# Altium schematic sheet DIOT_Backplane.SchDoc: =title_ (part 1 of 2)
size 594 x 420 mm; Date: 24/04/2023; CheckedBy: EG; GD; GK; MS; DrawnBy: M. Gąska; DocumentNumber: 1; SheetNumber: 1; SheetTotal: 5; DivGrp: BE-CO; Projet: DI/OT Crate; Title2: Top; Designer: G.Daniluk; CreateDate: 24/04/2023; CheckedDate: 24/04/2023
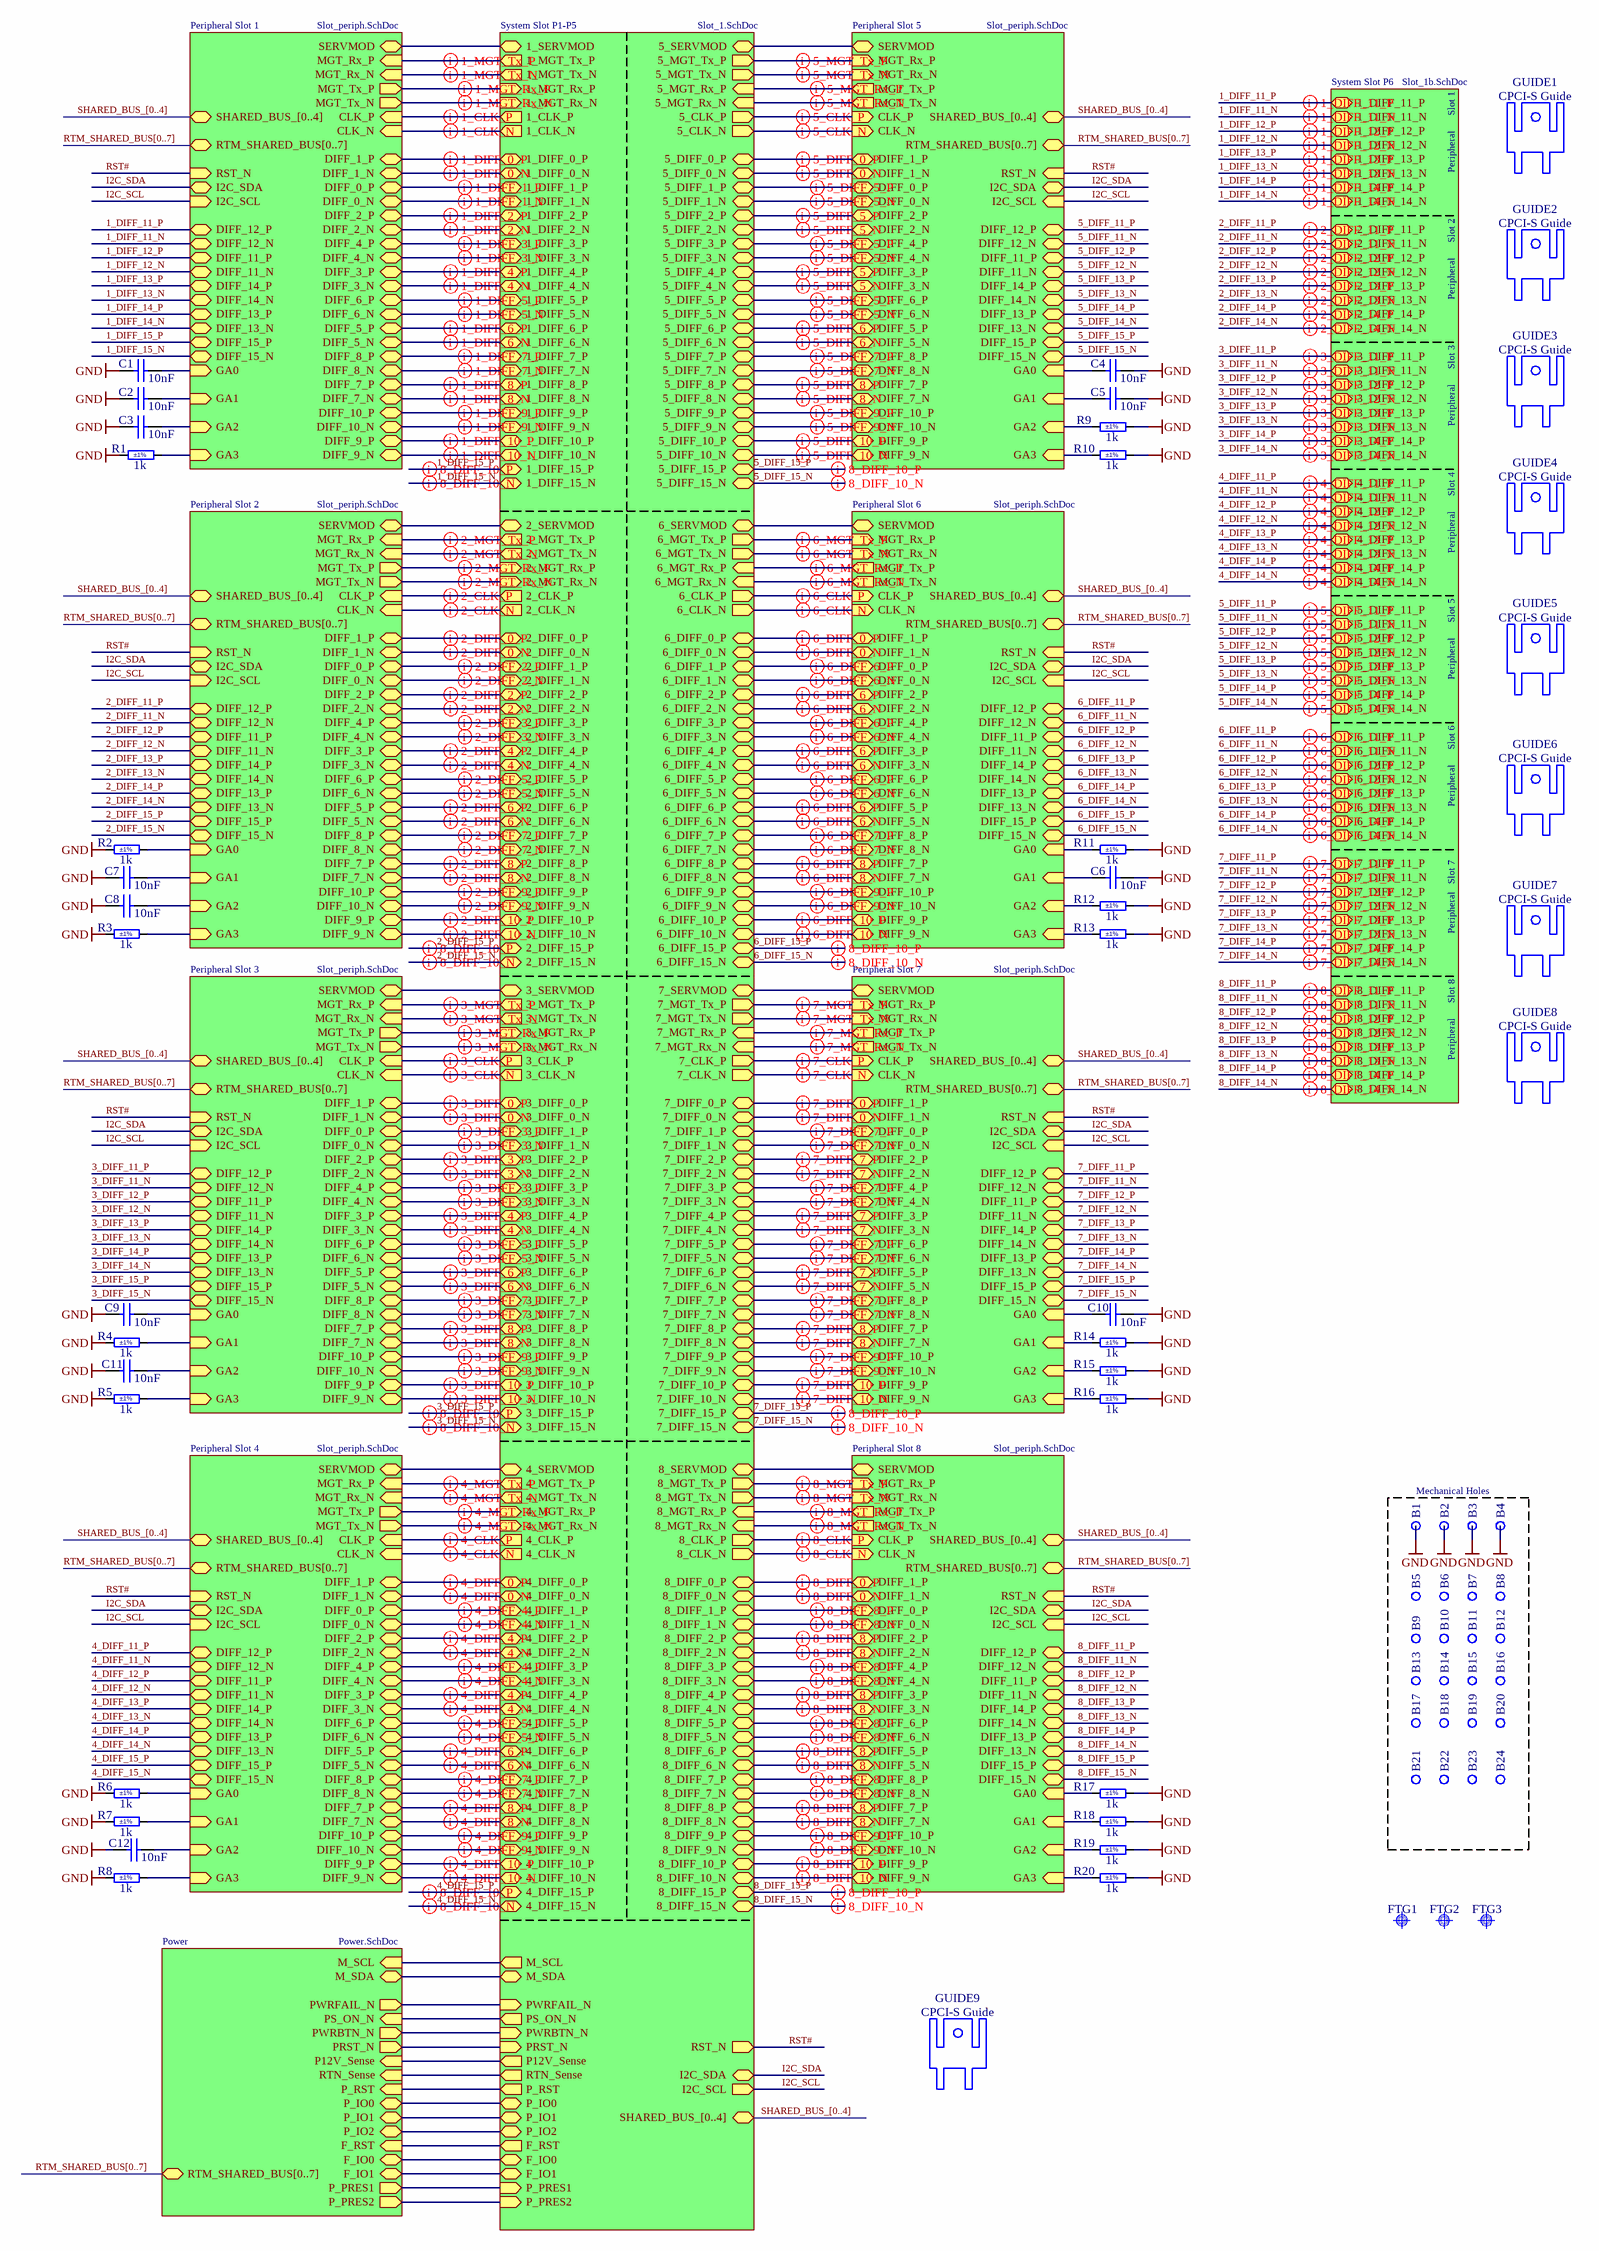
[diagram p0: DIOT_Backplane.SchDoc]

## Parts
B1  Non Plated Hole  [MTG270_500_NPTH_8FCVIAS_BOTSM]  (value not drawn)  (no BOM)
B2  Non Plated Hole  [MTG270_500_NPTH_8FCVIAS_BOTSM]  (value not drawn)  (no BOM)
B3  Non Plated Hole  [MTG270_500_NPTH_8FCVIAS_BOTSM]  (value not drawn)  (no BOM)
B4  Non Plated Hole  [MTG270_500_NPTH_8FCVIAS_BOTSM]  (value not drawn)  (no BOM)
B5  Non Plated Hole  [MTG270]  (value not drawn)  (no BOM)
B6  Non Plated Hole  [MTG270]  (value not drawn)  (no BOM)
B7  Non Plated Hole  [MTG270]  (value not drawn)  (no BOM)
B8  Non Plated Hole  [MTG270]  (value not drawn)  (no BOM)
B9  Non Plated Hole  [MTG270]  (value not drawn)  (no BOM)
B10  Non Plated Hole  [MTG270]  (value not drawn)  (no BOM)
B11  Non Plated Hole  [MTG270]  (value not drawn)  (no BOM)
B12  Non Plated Hole  [MTG270]  (value not drawn)  (no BOM)
B13  Non Plated Hole  [MTG270]  (value not drawn)  (no BOM)
B14  Non Plated Hole  [MTG270]  (value not drawn)  (no BOM)
B15  Non Plated Hole  [MTG270]  (value not drawn)  (no BOM)
B16  Non Plated Hole  [MTG270]  (value not drawn)  (no BOM)
B17  Non Plated Hole  [MTG270]  (value not drawn)  (no BOM)
B18  Non Plated Hole  [MTG270]  (value not drawn)  (no BOM)
B19  Non Plated Hole  [MTG270]  (value not drawn)  (no BOM)
B20  Non Plated Hole  [MTG270]  (value not drawn)  (no BOM)
B21  Non Plated Hole  [MTG270]  (value not drawn)  (no BOM)
B22  Non Plated Hole  [MTG270]  (value not drawn)  (no BOM)
B23  Non Plated Hole  [MTG270]  (value not drawn)  (no BOM)
B24  Non Plated Hole  [MTG270]  (value not drawn)  (no BOM)
C1  10nF  [CAPC1005X55N]
C2  10nF  [CAPC1005X55N]
C3  10nF  [CAPC1005X55N]
C4  10nF  [CAPC1005X55N]
C5  10nF  [CAPC1005X55N]
C6  10nF  [CAPC1005X55N]
C7  10nF  [CAPC1005X55N]
C8  10nF  [CAPC1005X55N]
C9  10nF  [CAPC1005X55N]
C10  10nF  [CAPC1005X55N]
C11  10nF  [CAPC1005X55N]
C12  10nF  [CAPC1005X55N]
FTG1  Use only in PCB  [FIDUCIAL_TOP_C100-200]  (value not drawn)
FTG2  Use only in PCB  [FIDUCIAL_TOP_C100-200]  (value not drawn)
FTG3  Use only in PCB  [FIDUCIAL_TOP_C100-200]  (value not drawn)
GUIDE1  CPCI-S Guide  [EDA-04126-V1-0]
GUIDE2  CPCI-S Guide  [EDA-04126-V1-0]
GUIDE3  CPCI-S Guide  [EDA-04126-V1-0]
GUIDE4  CPCI-S Guide  [EDA-04126-V1-0]
GUIDE5  CPCI-S Guide  [EDA-04126-V1-0]
GUIDE6  CPCI-S Guide  [EDA-04126-V1-0]
GUIDE7  CPCI-S Guide  [EDA-04126-V1-0]
GUIDE8  CPCI-S Guide  [EDA-04126-V1-0]
GUIDE9  CPCI-S Guide  [EDA-04126-V1-0]
R1  1k  Tolerance: ±1%  [RESC1005X40N]
R2  1k  Tolerance: ±1%  [RESC1005X40N]
R3  1k  Tolerance: ±1%  [RESC1005X40N]
R4  1k  Tolerance: ±1%  [RESC1005X40N]
R5  1k  Tolerance: ±1%  [RESC1005X40N]
R6  1k  Tolerance: ±1%  [RESC1005X40N]
R7  1k  Tolerance: ±1%  [RESC1005X40N]
R8  1k  Tolerance: ±1%  [RESC1005X40N]
R9  1k  Tolerance: ±1%  [RESC1005X40N]
R10  1k  Tolerance: ±1%  [RESC1005X40N]
R11  1k  Tolerance: ±1%  [RESC1005X40N]
R12  1k  Tolerance: ±1%  [RESC1005X40N]
R13  1k  Tolerance: ±1%  [RESC1005X40N]
R14  1k  Tolerance: ±1%  [RESC1005X40N]
R15  1k  Tolerance: ±1%  [RESC1005X40N]
R16  1k  Tolerance: ±1%  [RESC1005X40N]
R17  1k  Tolerance: ±1%  [RESC1005X40N]
R18  1k  Tolerance: ±1%  [RESC1005X40N]
R19  1k  Tolerance: ±1%  [RESC1005X40N]
R20  1k  Tolerance: ±1%  [RESC1005X40N]

## Blocks framed on the sheet
Mechanical Holes: B1-B24

## Sub-sheets
Peripheral Slot 1 = Slot_periph.SchDoc: I2C_SDA (bidir), I2C_SCL (in), GA3 (in), GA1 (in), GA2 (in), GA0 (in), SERVMOD (bidir), MGT_Tx_P (out), MGT_Tx_N (out), MGT_Rx_P (in), MGT_Rx_N (in), RST_N (in), DIFF_2_P (bidir), DIFF_2_N (bidir), DIFF_0_P (bidir), DIFF_0_N (bidir), DIFF_1_P (bidir), DIFF_1_N (bidir), DIFF_5_P (bidir), DIFF_5_N (bidir), DIFF_6_P (bidir), DIFF_6_N (bidir), DIFF_8_P (bidir), DIFF_8_N (bidir), DIFF_9_P (bidir), DIFF_9_N (bidir), DIFF_10_P (bidir), DIFF_10_N (bidir), DIFF_7_P (bidir), DIFF_7_N (bidir), DIFF_4_N (bidir), DIFF_4_P (bidir), DIFF_3_N (bidir), DIFF_3_P (bidir), CLK_N (in), CLK_P (in), RTM_SHARED_BUS[0..7] (bidir), SHARED_BUS_[0..4] (bidir), DIFF_11_P (bidir), DIFF_11_N (bidir), DIFF_12_P (bidir), DIFF_12_N (bidir), DIFF_13_P (bidir), DIFF_13_N (bidir), DIFF_14_P (bidir), DIFF_14_N (bidir), DIFF_15_P (bidir), DIFF_15_N (bidir)  | J8_Ref: J8; #PWR095_Ref: #PWR095; #PWR0132_Ref: #PWR0132; #PWR0139_Ref: #PWR0139; #PWR0146_Ref: #PWR0146; #PWR092_Ref: #PWR092; #PWR098_Ref: #PWR098; #PWR0135_Ref: #PWR0135; #PWR093_Ref: #PWR093; #PWR099_Ref: #PWR099; #PWR0136_Ref: #PWR0136; #PWR0143_Ref: #PWR0143; #PWR096_Ref: #PWR096; #PWR0133_Ref: #PWR0133; #PWR0140_Ref: #PWR0140; #PWR0147_Ref: #PWR0147; #PWR094_Ref: #PWR094; #PWR0100_Ref: #PWR0100; #PWR0137_Ref: #PWR0137; #PWR0144_Ref: #PWR0144; J40_Ref: J40; #PWR0101_Ref: #PWR0101; #PWR0102_Ref: #PWR0102; #PWR0103_Ref: #PWR0103; #PWR0104_Ref: #PWR0104; #PWR0109_Ref: #PWR0109; #PWR0110_Ref: #PWR0110; #PWR0111_Ref: #PWR0111; #PWR0112_Ref: #PWR0112; #PWR0113_Ref: #PWR0113; #PWR0114_Ref: #PWR0114; #PWR0115_Ref: #PWR0115; #PWR0116_Ref: #PWR0116; #PWR0117_Ref: #PWR0117; #PWR0118_Ref: #PWR0118; #PWR0119_Ref: #PWR0119; #PWR0120_Ref: #PWR0120; #PWR0121_Ref: #PWR0121; #PWR0122_Ref: #PWR0122; #PWR0123_Ref: #PWR0123; #PWR0124_Ref: #PWR0124; #PWR0125_Ref: #PWR0125; #PWR0126_Ref: #PWR0126; #PWR0127_Ref: #PWR0127; #PWR0128_Ref: #PWR0128; #PWR0129_Ref: #PWR0129; #PWR0130_Ref: #PWR0130; #PWR0179_Ref: #PWR0179; #PWR0185_Ref: #PWR0185; #PWR0192_Ref: #PWR0192; #PWR0199_Ref: #PWR0199; #PWR0200_Ref: #PWR0200; #PWR0232_Ref: #PWR0232; #PWR0142_Ref: #PWR0142; #PWR042_Ref: #PWR042; #PWR046_Ref: #PWR046; #PWR091_Ref: #PWR091; #PWR097_Ref: #PWR097; #PWR0131_Ref: #PWR0131; #PWR0134_Ref: #PWR0134; #PWR0138_Ref: #PWR0138; #PWR044_Ref: #PWR044; #PWR01167_Ref: #PWR01167; #PWR01169_Ref: #PWR01169; #PWR01296_Ref: #PWR01296; #PWR01297_Ref: #PWR01297; #PWR01295_Ref: #PWR01295; #PWR01171_Ref: #PWR01171; #PWR01165_Ref: #PWR01165; #PWR01163_Ref: #PWR01163; J23_Ref: J23; J7_Ref: J7; #PWR061_Ref: #PWR061; #PWR070_Ref: #PWR070; #PWR079_Ref: #PWR079; #PWR088_Ref: #PWR088; #PWR057_Ref: #PWR057; #PWR066_Ref: #PWR066; #PWR075_Ref: #PWR075; #PWR084_Ref: #PWR084; #PWR062_Ref: #PWR062; #PWR071_Ref: #PWR071; #PWR080_Ref: #PWR080; #PWR089_Ref: #PWR089; #PWR058_Ref: #PWR058; #PWR067_Ref: #PWR067; #PWR076_Ref: #PWR076; #PWR085_Ref: #PWR085; #PWR069_Ref: #PWR069; #PWR078_Ref: #PWR078; #PWR087_Ref: #PWR087; #PWR063_Ref: #PWR063; #PWR072_Ref: #PWR072; #PWR081_Ref: #PWR081; #PWR090_Ref: #PWR090; #PWR059_Ref: #PWR059; #PWR068_Ref: #PWR068; #PWR077_Ref: #PWR077; #PWR086_Ref: #PWR086; #PWR060_Ref: #PWR060; #PWR064_Ref: #PWR064; #PWR073_Ref: #PWR073; #PWR082_Ref: #PWR082; #PWR055_Ref: #PWR055; #PWR051_Ref: #PWR051; #PWR035_Ref: #PWR035; #PWR054_Ref: #PWR054; #PWR047_Ref: #PWR047; #PWR023_Ref: #PWR023; #PWR012_Ref: #PWR012; #PWR050_Ref: #PWR050; #PWR033_Ref: #PWR033; #PWR017_Ref: #PWR017; #PWR07_Ref: #PWR07; #PWR053_Ref: #PWR053; #PWR045_Ref: #PWR045; #PWR021_Ref: #PWR021; #PWR010_Ref: #PWR010; #PWR049_Ref: #PWR049; #PWR031_Ref: #PWR031; #PWR016_Ref: #PWR016; #PWR06_Ref: #PWR06; #PWR052_Ref: #PWR052; #PWR043_Ref: #PWR043; #PWR019_Ref: #PWR019; #PWR08_Ref: #PWR08; #PWR048_Ref: #PWR048; #PWR029_Ref: #PWR029; #PWR014_Ref: #PWR014; #PWR05_Ref: #PWR05; #PWR04_Ref: #PWR04; #PWR03_Ref: #PWR03; #PWR02_Ref: #PWR02; #PWR01_Ref: #PWR01
Peripheral Slot 2 = Slot_periph.SchDoc: SERVMOD (bidir), MGT_Tx_P (out), MGT_Tx_N (out), MGT_Rx_P (in), MGT_Rx_N (in), RST_N (in), I2C_SDA (bidir), I2C_SCL (in), DIFF_2_P (bidir), DIFF_2_N (bidir), DIFF_0_P (bidir), DIFF_0_N (bidir), DIFF_1_P (bidir), DIFF_1_N (bidir), DIFF_5_P (bidir), DIFF_5_N (bidir), DIFF_6_P (bidir), DIFF_6_N (bidir), DIFF_7_P (bidir), DIFF_7_N (bidir), DIFF_8_P (bidir), DIFF_8_N (bidir), DIFF_9_P (bidir), DIFF_9_N (bidir), DIFF_10_P (bidir), DIFF_10_N (bidir), DIFF_4_N (bidir), DIFF_4_P (bidir), DIFF_3_N (bidir), DIFF_3_P (bidir), CLK_N (in), CLK_P (in), GA3 (in), GA1 (in), GA2 (in), GA0 (in), RTM_SHARED_BUS[0..7] (bidir), SHARED_BUS_[0..4] (bidir), DIFF_11_P (bidir), DIFF_11_N (bidir), DIFF_12_P (bidir), DIFF_12_N (bidir), DIFF_13_P (bidir), DIFF_13_N (bidir), DIFF_14_P (bidir), DIFF_14_N (bidir), DIFF_15_P (bidir), DIFF_15_N (bidir)  | J8_Ref: J9; #PWR095_Ref: #PWR0148; #PWR0132_Ref: #PWR0151; #PWR0139_Ref: #PWR0154; #PWR0146_Ref: #PWR0157; #PWR092_Ref: #PWR0193; #PWR098_Ref: #PWR0194; #PWR0135_Ref: #PWR0195; #PWR093_Ref: #PWR0223; #PWR099_Ref: #PWR0224; #PWR0136_Ref: #PWR0225; #PWR0143_Ref: #PWR0226; #PWR096_Ref: #PWR0241; #PWR0133_Ref: #PWR0242; #PWR0140_Ref: #PWR0243; #PWR0147_Ref: #PWR0244; #PWR094_Ref: #PWR0271; #PWR0100_Ref: #PWR0272; #PWR0137_Ref: #PWR0273; #PWR0144_Ref: #PWR0274; J40_Ref: J11; #PWR0101_Ref: #PWR0169; #PWR0102_Ref: #PWR0171; #PWR0103_Ref: #PWR0173; #PWR0104_Ref: #PWR0167; #PWR0109_Ref: #PWR0178; #PWR0110_Ref: #PWR0180; #PWR0111_Ref: #PWR0181; #PWR0112_Ref: #PWR0182; #PWR0113_Ref: #PWR0207; #PWR0114_Ref: #PWR0208; #PWR0115_Ref: #PWR0209; #PWR0116_Ref: #PWR0210; #PWR0117_Ref: #PWR0219; #PWR0118_Ref: #PWR0220; #PWR0119_Ref: #PWR0221; #PWR0120_Ref: #PWR0222; #PWR0121_Ref: #PWR0236; #PWR0122_Ref: #PWR0237; #PWR0123_Ref: #PWR0239; #PWR0124_Ref: #PWR0240; #PWR0125_Ref: #PWR0255; #PWR0126_Ref: #PWR0256; #PWR0127_Ref: #PWR0257; #PWR0128_Ref: #PWR0258; #PWR0129_Ref: #PWR0267; #PWR0130_Ref: #PWR0268; #PWR0179_Ref: #PWR0269; #PWR0185_Ref: #PWR0270; #PWR0192_Ref: #PWR0281; #PWR0199_Ref: #PWR0282; #PWR0200_Ref: #PWR0283; #PWR0232_Ref: #PWR0284; #PWR0142_Ref: #PWR0196; #PWR042_Ref: #PWR0141; #PWR046_Ref: #PWR0149; #PWR091_Ref: #PWR0150; #PWR097_Ref: #PWR0152; #PWR0131_Ref: #PWR0153; #PWR0134_Ref: #PWR0155; #PWR0138_Ref: #PWR0156; #PWR044_Ref: #PWR0145; #PWR01167_Ref: #PWR0862; #PWR01169_Ref: #PWR0864; #PWR01296_Ref: #PWR01017; #PWR01297_Ref: #PWR01019; #PWR01295_Ref: #PWR01015; #PWR01171_Ref: #PWR0866; #PWR01165_Ref: #PWR0860; #PWR01163_Ref: #PWR0858; J23_Ref: J12; J7_Ref: J10; #PWR061_Ref: #PWR0203; #PWR070_Ref: #PWR0204; #PWR079_Ref: #PWR0205; #PWR088_Ref: #PWR0206; #PWR057_Ref: #PWR0215; #PWR066_Ref: #PWR0216; #PWR075_Ref: #PWR0217; #PWR084_Ref: #PWR0218; #PWR062_Ref: #PWR0231; #PWR071_Ref: #PWR0233; #PWR080_Ref: #PWR0234; #PWR089_Ref: #PWR0235; #PWR058_Ref: #PWR0250; #PWR067_Ref: #PWR0251; #PWR076_Ref: #PWR0253; #PWR085_Ref: #PWR0254; #PWR069_Ref: #PWR0161; #PWR078_Ref: #PWR0163; #PWR087_Ref: #PWR0165; #PWR063_Ref: #PWR0263; #PWR072_Ref: #PWR0264; #PWR081_Ref: #PWR0265; #PWR090_Ref: #PWR0266; #PWR059_Ref: #PWR0277; #PWR068_Ref: #PWR0278; #PWR077_Ref: #PWR0279; #PWR086_Ref: #PWR0280; #PWR060_Ref: #PWR0159; #PWR064_Ref: #PWR0184; #PWR073_Ref: #PWR0186; #PWR082_Ref: #PWR0187; #PWR055_Ref: #PWR0183; #PWR051_Ref: #PWR0276; #PWR035_Ref: #PWR0275; #PWR054_Ref: #PWR0262; #PWR047_Ref: #PWR0261; #PWR023_Ref: #PWR0260; #PWR012_Ref: #PWR0259; #PWR050_Ref: #PWR0249; #PWR033_Ref: #PWR0248; #PWR017_Ref: #PWR0247; #PWR07_Ref: #PWR0246; #PWR053_Ref: #PWR0230; #PWR045_Ref: #PWR0229; #PWR021_Ref: #PWR0228; #PWR010_Ref: #PWR0227; #PWR049_Ref: #PWR0214; #PWR031_Ref: #PWR0213; #PWR016_Ref: #PWR0212; #PWR06_Ref: #PWR0211; #PWR052_Ref: #PWR0202; #PWR043_Ref: #PWR0201; #PWR019_Ref: #PWR0198; #PWR08_Ref: #PWR0197; #PWR048_Ref: #PWR0191; #PWR029_Ref: #PWR0190; #PWR014_Ref: #PWR0189; #PWR05_Ref: #PWR0188; #PWR04_Ref: #PWR0177; #PWR03_Ref: #PWR0176; #PWR02_Ref: #PWR0175; #PWR01_Ref: #PWR0174
Peripheral Slot 3 = Slot_periph.SchDoc: SERVMOD (bidir), MGT_Tx_P (out), MGT_Tx_N (out), MGT_Rx_P (in), MGT_Rx_N (in), RST_N (in), I2C_SDA (bidir), I2C_SCL (in), DIFF_2_P (bidir), DIFF_2_N (bidir), DIFF_0_P (bidir), DIFF_0_N (bidir), DIFF_1_P (bidir), DIFF_1_N (bidir), DIFF_5_P (bidir), DIFF_5_N (bidir), DIFF_6_P (bidir), DIFF_6_N (bidir), DIFF_7_P (bidir), DIFF_7_N (bidir), DIFF_8_P (bidir), DIFF_8_N (bidir), DIFF_9_P (bidir), DIFF_9_N (bidir), DIFF_10_P (bidir), DIFF_10_N (bidir), DIFF_4_N (bidir), DIFF_4_P (bidir), DIFF_3_N (bidir), DIFF_3_P (bidir), CLK_N (in), CLK_P (in), GA3 (in), GA1 (in), GA2 (in), GA0 (in), RTM_SHARED_BUS[0..7] (bidir), SHARED_BUS_[0..4] (bidir), DIFF_11_P (bidir), DIFF_11_N (bidir), DIFF_12_P (bidir), DIFF_12_N (bidir), DIFF_13_P (bidir), DIFF_13_N (bidir), DIFF_14_P (bidir), DIFF_14_N (bidir), DIFF_15_P (bidir), DIFF_15_N (bidir)  | J8_Ref: J13; #PWR095_Ref: #PWR0288; #PWR0132_Ref: #PWR0292; #PWR0139_Ref: #PWR0295; #PWR0146_Ref: #PWR0299; #PWR092_Ref: #PWR0332; #PWR098_Ref: #PWR0333; #PWR0135_Ref: #PWR0334; #PWR093_Ref: #PWR0360; #PWR099_Ref: #PWR0361; #PWR0136_Ref: #PWR0362; #PWR0143_Ref: #PWR0363; #PWR096_Ref: #PWR0376; #PWR0133_Ref: #PWR0377; #PWR0140_Ref: #PWR0378; #PWR0147_Ref: #PWR0379; #PWR094_Ref: #PWR0404; #PWR0100_Ref: #PWR0405; #PWR0137_Ref: #PWR0406; #PWR0144_Ref: #PWR0407; J40_Ref: J15; #PWR0101_Ref: #PWR0311; #PWR0102_Ref: #PWR0313; #PWR0103_Ref: #PWR0315; #PWR0104_Ref: #PWR0309; #PWR0109_Ref: #PWR0320; #PWR0110_Ref: #PWR0321; #PWR0111_Ref: #PWR0322; #PWR0112_Ref: #PWR0323; #PWR0113_Ref: #PWR0344; #PWR0114_Ref: #PWR0345; #PWR0115_Ref: #PWR0346; #PWR0116_Ref: #PWR0347; #PWR0117_Ref: #PWR0356; #PWR0118_Ref: #PWR0357; #PWR0119_Ref: #PWR0358; #PWR0120_Ref: #PWR0359; #PWR0121_Ref: #PWR0372; #PWR0122_Ref: #PWR0373; #PWR0123_Ref: #PWR0374; #PWR0124_Ref: #PWR0375; #PWR0125_Ref: #PWR0388; #PWR0126_Ref: #PWR0389; #PWR0127_Ref: #PWR0390; #PWR0128_Ref: #PWR0391; #PWR0129_Ref: #PWR0400; #PWR0130_Ref: #PWR0401; #PWR0179_Ref: #PWR0402; #PWR0185_Ref: #PWR0403; #PWR0192_Ref: #PWR0414; #PWR0199_Ref: #PWR0415; #PWR0200_Ref: #PWR0416; #PWR0232_Ref: #PWR0417; #PWR0142_Ref: #PWR0335; #PWR042_Ref: #PWR0286; #PWR046_Ref: #PWR0289; #PWR091_Ref: #PWR0290; #PWR097_Ref: #PWR0293; #PWR0131_Ref: #PWR0294; #PWR0134_Ref: #PWR0296; #PWR0138_Ref: #PWR0297; #PWR044_Ref: #PWR0287; #PWR01167_Ref: #PWR0158; #PWR01169_Ref: #PWR0160; #PWR01296_Ref: #PWR0166; #PWR01297_Ref: #PWR0168; #PWR01295_Ref: #PWR0164; #PWR01171_Ref: #PWR0162; #PWR01165_Ref: #PWR0108; #PWR01163_Ref: #PWR0107; J23_Ref: J16; J7_Ref: J14; #PWR061_Ref: #PWR0340; #PWR070_Ref: #PWR0341; #PWR079_Ref: #PWR0342; #PWR088_Ref: #PWR0343; #PWR057_Ref: #PWR0352; #PWR066_Ref: #PWR0353; #PWR075_Ref: #PWR0354; #PWR084_Ref: #PWR0355; #PWR062_Ref: #PWR0368; #PWR071_Ref: #PWR0369; #PWR080_Ref: #PWR0370; #PWR089_Ref: #PWR0371; #PWR058_Ref: #PWR0384; #PWR067_Ref: #PWR0385; #PWR076_Ref: #PWR0386; #PWR085_Ref: #PWR0387; #PWR069_Ref: #PWR0303; #PWR078_Ref: #PWR0305; #PWR087_Ref: #PWR0307; #PWR063_Ref: #PWR0396; #PWR072_Ref: #PWR0397; #PWR081_Ref: #PWR0398; #PWR090_Ref: #PWR0399; #PWR059_Ref: #PWR0410; #PWR068_Ref: #PWR0411; #PWR077_Ref: #PWR0412; #PWR086_Ref: #PWR0413; #PWR060_Ref: #PWR0301; #PWR064_Ref: #PWR0325; #PWR073_Ref: #PWR0326; #PWR082_Ref: #PWR0327; #PWR055_Ref: #PWR0324; #PWR051_Ref: #PWR0409; #PWR035_Ref: #PWR0408; #PWR054_Ref: #PWR0395; #PWR047_Ref: #PWR0394; #PWR023_Ref: #PWR0393; #PWR012_Ref: #PWR0392; #PWR050_Ref: #PWR0383; #PWR033_Ref: #PWR0382; #PWR017_Ref: #PWR0381; #PWR07_Ref: #PWR0380; #PWR053_Ref: #PWR0367; #PWR045_Ref: #PWR0366; #PWR021_Ref: #PWR0365; #PWR010_Ref: #PWR0364; #PWR049_Ref: #PWR0351; #PWR031_Ref: #PWR0350; #PWR016_Ref: #PWR0349; #PWR06_Ref: #PWR0348; #PWR052_Ref: #PWR0339; #PWR043_Ref: #PWR0338; #PWR019_Ref: #PWR0337; #PWR08_Ref: #PWR0336; #PWR048_Ref: #PWR0331; #PWR029_Ref: #PWR0330; #PWR014_Ref: #PWR0329; #PWR05_Ref: #PWR0328; #PWR04_Ref: #PWR0319; #PWR03_Ref: #PWR0318; #PWR02_Ref: #PWR0317; #PWR01_Ref: #PWR0316
Peripheral Slot 4 = Slot_periph.SchDoc: SERVMOD (bidir), MGT_Tx_P (out), MGT_Tx_N (out), MGT_Rx_P (in), MGT_Rx_N (in), RST_N (in), I2C_SDA (bidir), I2C_SCL (in), DIFF_2_P (bidir), DIFF_2_N (bidir), DIFF_0_P (bidir), DIFF_0_N (bidir), DIFF_1_P (bidir), DIFF_1_N (bidir), DIFF_5_P (bidir), DIFF_5_N (bidir), DIFF_6_P (bidir), DIFF_6_N (bidir), DIFF_7_P (bidir), DIFF_7_N (bidir), DIFF_8_P (bidir), DIFF_8_N (bidir), DIFF_9_P (bidir), DIFF_9_N (bidir), DIFF_10_P (bidir), DIFF_10_N (bidir), DIFF_4_N (bidir), DIFF_4_P (bidir), DIFF_3_N (bidir), DIFF_3_P (bidir), CLK_N (in), CLK_P (in), GA3 (in), GA1 (in), GA2 (in), GA0 (in), RTM_SHARED_BUS[0..7] (bidir), SHARED_BUS_[0..4] (bidir), DIFF_11_P (bidir), DIFF_11_N (bidir), DIFF_12_P (bidir), DIFF_12_N (bidir), DIFF_13_P (bidir), DIFF_13_N (bidir), DIFF_14_P (bidir), DIFF_14_N (bidir), DIFF_15_P (bidir), DIFF_15_N (bidir)  | J8_Ref: J17; #PWR095_Ref: #PWR0420; #PWR0132_Ref: #PWR0423; #PWR0139_Ref: #PWR0426; #PWR0146_Ref: #PWR0429; #PWR092_Ref: #PWR0462; #PWR098_Ref: #PWR0463; #PWR0135_Ref: #PWR0464; #PWR093_Ref: #PWR0490; #PWR099_Ref: #PWR0491; #PWR0136_Ref: #PWR0492; #PWR0143_Ref: #PWR0493; #PWR096_Ref: #PWR0506; #PWR0133_Ref: #PWR0507; #PWR0140_Ref: #PWR0508; #PWR0147_Ref: #PWR0509; #PWR094_Ref: #PWR0678; #PWR0100_Ref: #PWR0679; #PWR0137_Ref: #PWR0680; #PWR0144_Ref: #PWR0682; J40_Ref: J19; #PWR0101_Ref: #PWR0441; #PWR0102_Ref: #PWR0443; #PWR0103_Ref: #PWR0445; #PWR0104_Ref: #PWR0439; #PWR0109_Ref: #PWR0450; #PWR0110_Ref: #PWR0451; #PWR0111_Ref: #PWR0452; #PWR0112_Ref: #PWR0453; #PWR0113_Ref: #PWR0474; #PWR0114_Ref: #PWR0475; #PWR0115_Ref: #PWR0476; #PWR0116_Ref: #PWR0477; #PWR0117_Ref: #PWR0486; #PWR0118_Ref: #PWR0487; #PWR0119_Ref: #PWR0488; #PWR0120_Ref: #PWR0489; #PWR0121_Ref: #PWR0502; #PWR0122_Ref: #PWR0503; #PWR0123_Ref: #PWR0504; #PWR0124_Ref: #PWR0505; #PWR0125_Ref: #PWR0518; #PWR0126_Ref: #PWR0519; #PWR0127_Ref: #PWR0520; #PWR0128_Ref: #PWR0521; #PWR0129_Ref: #PWR0666; #PWR0130_Ref: #PWR0668; #PWR0179_Ref: #PWR0674; #PWR0185_Ref: #PWR0675; #PWR0192_Ref: #PWR0691; #PWR0199_Ref: #PWR0692; #PWR0200_Ref: #PWR0693; #PWR0232_Ref: #PWR0694; #PWR0142_Ref: #PWR0465; #PWR042_Ref: #PWR0418; #PWR046_Ref: #PWR0421; #PWR091_Ref: #PWR0422; #PWR097_Ref: #PWR0424; #PWR0131_Ref: #PWR0425; #PWR0134_Ref: #PWR0427; #PWR0138_Ref: #PWR0428; #PWR044_Ref: #PWR0419; #PWR01167_Ref: #PWR0300; #PWR01169_Ref: #PWR0302; #PWR01296_Ref: #PWR0308; #PWR01297_Ref: #PWR0310; #PWR01295_Ref: #PWR0306; #PWR01171_Ref: #PWR0304; #PWR01165_Ref: #PWR0172; #PWR01163_Ref: #PWR0170; J23_Ref: J20; J7_Ref: J18; #PWR061_Ref: #PWR0470; #PWR070_Ref: #PWR0471; #PWR079_Ref: #PWR0472; #PWR088_Ref: #PWR0473; #PWR057_Ref: #PWR0482; #PWR066_Ref: #PWR0483; #PWR075_Ref: #PWR0484; #PWR084_Ref: #PWR0485; #PWR062_Ref: #PWR0498; #PWR071_Ref: #PWR0499; #PWR080_Ref: #PWR0500; #PWR089_Ref: #PWR0501; #PWR058_Ref: #PWR0514; #PWR067_Ref: #PWR0515; #PWR076_Ref: #PWR0516; #PWR085_Ref: #PWR0517; #PWR069_Ref: #PWR0433; #PWR078_Ref: #PWR0435; #PWR087_Ref: #PWR0437; #PWR063_Ref: #PWR0647; #PWR072_Ref: #PWR0651; #PWR081_Ref: #PWR0655; #PWR090_Ref: #PWR0659; #PWR059_Ref: #PWR0687; #PWR068_Ref: #PWR0688; #PWR077_Ref: #PWR0689; #PWR086_Ref: #PWR0690; #PWR060_Ref: #PWR0431; #PWR064_Ref: #PWR0455; #PWR073_Ref: #PWR0456; #PWR082_Ref: #PWR0457; #PWR055_Ref: #PWR0454; #PWR051_Ref: #PWR0686; #PWR035_Ref: #PWR0685; #PWR054_Ref: #PWR0644; #PWR047_Ref: #PWR0640; #PWR023_Ref: #PWR0634; #PWR012_Ref: #PWR0522; #PWR050_Ref: #PWR0513; #PWR033_Ref: #PWR0512; #PWR017_Ref: #PWR0511; #PWR07_Ref: #PWR0510; #PWR053_Ref: #PWR0497; #PWR045_Ref: #PWR0496; #PWR021_Ref: #PWR0495; #PWR010_Ref: #PWR0494; #PWR049_Ref: #PWR0481; #PWR031_Ref: #PWR0480; #PWR016_Ref: #PWR0479; #PWR06_Ref: #PWR0478; #PWR052_Ref: #PWR0469; #PWR043_Ref: #PWR0468; #PWR019_Ref: #PWR0467; #PWR08_Ref: #PWR0466; #PWR048_Ref: #PWR0461; #PWR029_Ref: #PWR0460; #PWR014_Ref: #PWR0459; #PWR05_Ref: #PWR0458; #PWR04_Ref: #PWR0449; #PWR03_Ref: #PWR0448; #PWR02_Ref: #PWR0447; #PWR01_Ref: #PWR0446
Peripheral Slot 5 = Slot_periph.SchDoc: SERVMOD (bidir), MGT_Tx_P (out), MGT_Tx_N (out), MGT_Rx_P (in), MGT_Rx_N (in), RST_N (in), I2C_SDA (bidir), I2C_SCL (in), DIFF_2_P (bidir), DIFF_2_N (bidir), DIFF_0_P (bidir), DIFF_0_N (bidir), DIFF_1_P (bidir), DIFF_1_N (bidir), DIFF_5_P (bidir), DIFF_5_N (bidir), DIFF_6_P (bidir), DIFF_6_N (bidir), DIFF_7_P (bidir), DIFF_7_N (bidir), DIFF_8_P (bidir), DIFF_8_N (bidir), DIFF_9_P (bidir), DIFF_9_N (bidir), DIFF_10_P (bidir), DIFF_10_N (bidir), DIFF_4_N (bidir), DIFF_4_P (bidir), DIFF_3_N (bidir), DIFF_3_P (bidir), CLK_N (in), CLK_P (in), GA3 (in), GA1 (in), GA2 (in), GA0 (in), RTM_SHARED_BUS[0..7] (bidir), SHARED_BUS_[0..4] (bidir), DIFF_11_P (bidir), DIFF_11_N (bidir), DIFF_12_P (bidir), DIFF_12_N (bidir), DIFF_13_P (bidir), DIFF_13_N (bidir), DIFF_14_P (bidir), DIFF_14_N (bidir), DIFF_15_P (bidir), DIFF_15_N (bidir)  | J8_Ref: J21; #PWR095_Ref: #PWR0697; #PWR0132_Ref: #PWR0700; #PWR0139_Ref: #PWR0703; #PWR0146_Ref: #PWR0706; #PWR092_Ref: #PWR0739; #PWR098_Ref: #PWR0740; #PWR0135_Ref: #PWR0743; #PWR093_Ref: #PWR0773; #PWR099_Ref: #PWR0774; #PWR0136_Ref: #PWR0775; #PWR0143_Ref: #PWR0776; #PWR096_Ref: #PWR0790; #PWR0133_Ref: #PWR0791; #PWR0140_Ref: #PWR0792; #PWR0147_Ref: #PWR0793; #PWR094_Ref: #PWR0818; #PWR0100_Ref: #PWR0819; #PWR0137_Ref: #PWR0820; #PWR0144_Ref: #PWR0821; J40_Ref: J34; #PWR0101_Ref: #PWR0718; #PWR0102_Ref: #PWR0720; #PWR0103_Ref: #PWR0722; #PWR0104_Ref: #PWR0716; #PWR0109_Ref: #PWR0727; #PWR0110_Ref: #PWR0728; #PWR0111_Ref: #PWR0729; #PWR0112_Ref: #PWR0730; #PWR0113_Ref: #PWR0757; #PWR0114_Ref: #PWR0758; #PWR0115_Ref: #PWR0759; #PWR0116_Ref: #PWR0760; #PWR0117_Ref: #PWR0769; #PWR0118_Ref: #PWR0770; #PWR0119_Ref: #PWR0771; #PWR0120_Ref: #PWR0772; #PWR0121_Ref: #PWR0786; #PWR0122_Ref: #PWR0787; #PWR0123_Ref: #PWR0788; #PWR0124_Ref: #PWR0789; #PWR0125_Ref: #PWR0802; #PWR0126_Ref: #PWR0803; #PWR0127_Ref: #PWR0804; #PWR0128_Ref: #PWR0805; #PWR0129_Ref: #PWR0814; #PWR0130_Ref: #PWR0815; #PWR0179_Ref: #PWR0816; #PWR0185_Ref: #PWR0817; #PWR0192_Ref: #PWR0835; #PWR0199_Ref: #PWR0837; #PWR0200_Ref: #PWR0838; #PWR0232_Ref: #PWR0839; #PWR0142_Ref: #PWR0744; #PWR042_Ref: #PWR0695; #PWR046_Ref: #PWR0698; #PWR091_Ref: #PWR0699; #PWR097_Ref: #PWR0701; #PWR0131_Ref: #PWR0702; #PWR0134_Ref: #PWR0704; #PWR0138_Ref: #PWR0705; #PWR044_Ref: #PWR0696; #PWR01167_Ref: #PWR01025; #PWR01169_Ref: #PWR01029; #PWR01296_Ref: #PWR01159; #PWR01297_Ref: #PWR01161; #PWR01295_Ref: #PWR01157; #PWR01171_Ref: #PWR01031; #PWR01165_Ref: #PWR01023; #PWR01163_Ref: #PWR01021; J23_Ref: J35; J7_Ref: J22; #PWR061_Ref: #PWR0753; #PWR070_Ref: #PWR0754; #PWR079_Ref: #PWR0755; #PWR088_Ref: #PWR0756; #PWR057_Ref: #PWR0765; #PWR066_Ref: #PWR0766; #PWR075_Ref: #PWR0767; #PWR084_Ref: #PWR0768; #PWR062_Ref: #PWR0781; #PWR071_Ref: #PWR0782; #PWR080_Ref: #PWR0784; #PWR089_Ref: #PWR0785; #PWR058_Ref: #PWR0798; #PWR067_Ref: #PWR0799; #PWR076_Ref: #PWR0800; #PWR085_Ref: #PWR0801; #PWR069_Ref: #PWR0710; #PWR078_Ref: #PWR0712; #PWR087_Ref: #PWR0714; #PWR063_Ref: #PWR0810; #PWR072_Ref: #PWR0811; #PWR081_Ref: #PWR0812; #PWR090_Ref: #PWR0813; #PWR059_Ref: #PWR0826; #PWR068_Ref: #PWR0827; #PWR077_Ref: #PWR0828; #PWR086_Ref: #PWR0833; #PWR060_Ref: #PWR0708; #PWR064_Ref: #PWR0732; #PWR073_Ref: #PWR0733; #PWR082_Ref: #PWR0734; #PWR055_Ref: #PWR0731; #PWR051_Ref: #PWR0825; #PWR035_Ref: #PWR0822; #PWR054_Ref: #PWR0809; #PWR047_Ref: #PWR0808; #PWR023_Ref: #PWR0807; #PWR012_Ref: #PWR0806; #PWR050_Ref: #PWR0797; #PWR033_Ref: #PWR0796; #PWR017_Ref: #PWR0795; #PWR07_Ref: #PWR0794; #PWR053_Ref: #PWR0780; #PWR045_Ref: #PWR0779; #PWR021_Ref: #PWR0778; #PWR010_Ref: #PWR0777; #PWR049_Ref: #PWR0764; #PWR031_Ref: #PWR0763; #PWR016_Ref: #PWR0762; #PWR06_Ref: #PWR0761; #PWR052_Ref: #PWR0752; #PWR043_Ref: #PWR0751; #PWR019_Ref: #PWR0746; #PWR08_Ref: #PWR0745; #PWR048_Ref: #PWR0738; #PWR029_Ref: #PWR0737; #PWR014_Ref: #PWR0736; #PWR05_Ref: #PWR0735; #PWR04_Ref: #PWR0726; #PWR03_Ref: #PWR0725; #PWR02_Ref: #PWR0724; #PWR01_Ref: #PWR0723
Peripheral Slot 6 = Slot_periph.SchDoc: SERVMOD (bidir), MGT_Tx_P (out), MGT_Tx_N (out), MGT_Rx_P (in), MGT_Rx_N (in), RST_N (in), I2C_SDA (bidir), I2C_SCL (in), DIFF_2_P (bidir), DIFF_2_N (bidir), DIFF_0_P (bidir), DIFF_0_N (bidir), DIFF_1_P (bidir), DIFF_1_N (bidir), DIFF_5_P (bidir), DIFF_5_N (bidir), DIFF_6_P (bidir), DIFF_6_N (bidir), DIFF_7_P (bidir), DIFF_7_N (bidir), DIFF_8_P (bidir), DIFF_8_N (bidir), DIFF_9_P (bidir), DIFF_9_N (bidir), DIFF_10_P (bidir), DIFF_10_N (bidir), DIFF_4_N (bidir), DIFF_4_P (bidir), DIFF_3_N (bidir), DIFF_3_P (bidir), CLK_N (in), CLK_P (in), GA3 (in), GA1 (in), GA2 (in), GA0 (in), RTM_SHARED_BUS[0..7] (bidir), SHARED_BUS_[0..4] (bidir), DIFF_11_P (bidir), DIFF_11_N (bidir), DIFF_12_P (bidir), DIFF_12_N (bidir), DIFF_13_P (bidir), DIFF_13_N (bidir), DIFF_14_P (bidir), DIFF_14_N (bidir), DIFF_15_P (bidir), DIFF_15_N (bidir)  | J8_Ref: J36; #PWR095_Ref: #PWR0842; #PWR0132_Ref: #PWR0845; #PWR0139_Ref: #PWR0848; #PWR0146_Ref: #PWR0851; #PWR092_Ref: #PWR0884; #PWR098_Ref: #PWR0885; #PWR0135_Ref: #PWR0886; #PWR093_Ref: #PWR0914; #PWR099_Ref: #PWR0915; #PWR0136_Ref: #PWR0916; #PWR0143_Ref: #PWR0917; #PWR096_Ref: #PWR0961; #PWR0133_Ref: #PWR0962; #PWR0140_Ref: #PWR0963; #PWR0147_Ref: #PWR0964; #PWR094_Ref: #PWR0989; #PWR0100_Ref: #PWR0990; #PWR0137_Ref: #PWR0991; #PWR0144_Ref: #PWR0992; J40_Ref: J38; #PWR0101_Ref: #PWR0863; #PWR0102_Ref: #PWR0865; #PWR0103_Ref: #PWR0867; #PWR0104_Ref: #PWR0861; #PWR0109_Ref: #PWR0872; #PWR0110_Ref: #PWR0873; #PWR0111_Ref: #PWR0874; #PWR0112_Ref: #PWR0875; #PWR0113_Ref: #PWR0896; #PWR0114_Ref: #PWR0897; #PWR0115_Ref: #PWR0898; #PWR0116_Ref: #PWR0899; #PWR0117_Ref: #PWR0908; #PWR0118_Ref: #PWR0909; #PWR0119_Ref: #PWR0910; #PWR0120_Ref: #PWR0913; #PWR0121_Ref: #PWR0957; #PWR0122_Ref: #PWR0958; #PWR0123_Ref: #PWR0959; #PWR0124_Ref: #PWR0960; #PWR0125_Ref: #PWR0973; #PWR0126_Ref: #PWR0974; #PWR0127_Ref: #PWR0975; #PWR0128_Ref: #PWR0976; #PWR0129_Ref: #PWR0985; #PWR0130_Ref: #PWR0986; #PWR0179_Ref: #PWR0987; #PWR0185_Ref: #PWR0988; #PWR0192_Ref: #PWR0999; #PWR0199_Ref: #PWR01000; #PWR0200_Ref: #PWR01001; #PWR0232_Ref: #PWR01002; #PWR0142_Ref: #PWR0887; #PWR042_Ref: #PWR0840; #PWR046_Ref: #PWR0843; #PWR091_Ref: #PWR0844; #PWR097_Ref: #PWR0846; #PWR0131_Ref: #PWR0847; #PWR0134_Ref: #PWR0849; #PWR0138_Ref: #PWR0850; #PWR044_Ref: #PWR0841; #PWR01167_Ref: #PWR0430; #PWR01169_Ref: #PWR0432; #PWR01296_Ref: #PWR0438; #PWR01297_Ref: #PWR0440; #PWR01295_Ref: #PWR0436; #PWR01171_Ref: #PWR0434; #PWR01165_Ref: #PWR0314; #PWR01163_Ref: #PWR0312; J23_Ref: J39; J7_Ref: J37; #PWR061_Ref: #PWR0892; #PWR070_Ref: #PWR0893; #PWR079_Ref: #PWR0894; #PWR088_Ref: #PWR0895; #PWR057_Ref: #PWR0904; #PWR066_Ref: #PWR0905; #PWR075_Ref: #PWR0906; #PWR084_Ref: #PWR0907; #PWR062_Ref: #PWR0925; #PWR071_Ref: #PWR0954; #PWR080_Ref: #PWR0955; #PWR089_Ref: #PWR0956; #PWR058_Ref: #PWR0969; #PWR067_Ref: #PWR0970; #PWR076_Ref: #PWR0971; #PWR085_Ref: #PWR0972; #PWR069_Ref: #PWR0855; #PWR078_Ref: #PWR0857; #PWR087_Ref: #PWR0859; #PWR063_Ref: #PWR0981; #PWR072_Ref: #PWR0982; #PWR081_Ref: #PWR0983; #PWR090_Ref: #PWR0984; #PWR059_Ref: #PWR0995; #PWR068_Ref: #PWR0996; #PWR077_Ref: #PWR0997; #PWR086_Ref: #PWR0998; #PWR060_Ref: #PWR0853; #PWR064_Ref: #PWR0877; #PWR073_Ref: #PWR0878; #PWR082_Ref: #PWR0879; #PWR055_Ref: #PWR0876; #PWR051_Ref: #PWR0994; #PWR035_Ref: #PWR0993; #PWR054_Ref: #PWR0980; #PWR047_Ref: #PWR0979; #PWR023_Ref: #PWR0978; #PWR012_Ref: #PWR0977; #PWR050_Ref: #PWR0968; #PWR033_Ref: #PWR0967; #PWR017_Ref: #PWR0966; #PWR07_Ref: #PWR0965; #PWR053_Ref: #PWR0924; #PWR045_Ref: #PWR0923; #PWR021_Ref: #PWR0922; #PWR010_Ref: #PWR0919; #PWR049_Ref: #PWR0903; #PWR031_Ref: #PWR0902; #PWR016_Ref: #PWR0901; #PWR06_Ref: #PWR0900; #PWR052_Ref: #PWR0891; #PWR043_Ref: #PWR0890; #PWR019_Ref: #PWR0889; #PWR08_Ref: #PWR0888; #PWR048_Ref: #PWR0883; #PWR029_Ref: #PWR0882; #PWR014_Ref: #PWR0881; #PWR05_Ref: #PWR0880; #PWR04_Ref: #PWR0871; #PWR03_Ref: #PWR0870; #PWR02_Ref: #PWR0869; #PWR01_Ref: #PWR0868
Peripheral Slot 7 = Slot_periph.SchDoc: SERVMOD (bidir), MGT_Tx_P (out), MGT_Tx_N (out), MGT_Rx_P (in), MGT_Rx_N (in), RST_N (in), I2C_SDA (bidir), I2C_SCL (in), DIFF_2_P (bidir), DIFF_2_N (bidir), DIFF_0_P (bidir), DIFF_0_N (bidir), DIFF_1_P (bidir), DIFF_1_N (bidir), DIFF_5_P (bidir), DIFF_5_N (bidir), DIFF_6_P (bidir), DIFF_6_N (bidir), DIFF_7_P (bidir), DIFF_7_N (bidir), DIFF_8_P (bidir), DIFF_8_N (bidir), DIFF_9_P (bidir), DIFF_9_N (bidir), DIFF_10_P (bidir), DIFF_10_N (bidir), DIFF_4_N (bidir), DIFF_4_P (bidir), DIFF_3_N (bidir), DIFF_3_P (bidir), CLK_N (in), CLK_P (in), GA3 (in), GA1 (in), GA2 (in), GA0 (in), RTM_SHARED_BUS[0..7] (bidir), SHARED_BUS_[0..4] (bidir), DIFF_11_P (bidir), DIFF_11_N (bidir), DIFF_12_P (bidir), DIFF_12_N (bidir), DIFF_13_P (bidir), DIFF_13_N (bidir), DIFF_14_P (bidir), DIFF_14_N (bidir), DIFF_15_P (bidir), DIFF_15_N (bidir)  | J8_Ref: J41; #PWR095_Ref: #PWR01005; #PWR0132_Ref: #PWR01008; #PWR0139_Ref: #PWR01011; #PWR0146_Ref: #PWR01014; #PWR092_Ref: #PWR01053; #PWR098_Ref: #PWR01054; #PWR0135_Ref: #PWR01055; #PWR093_Ref: #PWR01081; #PWR099_Ref: #PWR01082; #PWR0136_Ref: #PWR01083; #PWR0143_Ref: #PWR01084; #PWR096_Ref: #PWR01097; #PWR0133_Ref: #PWR01098; #PWR0140_Ref: #PWR01099; #PWR0147_Ref: #PWR01100; #PWR094_Ref: #PWR01131; #PWR0100_Ref: #PWR01132; #PWR0137_Ref: #PWR01133; #PWR0144_Ref: #PWR01134; J40_Ref: J43; #PWR0101_Ref: #PWR01028; #PWR0102_Ref: #PWR01030; #PWR0103_Ref: #PWR01036; #PWR0104_Ref: #PWR01024; #PWR0109_Ref: #PWR01041; #PWR0110_Ref: #PWR01042; #PWR0111_Ref: #PWR01043; #PWR0112_Ref: #PWR01044; #PWR0113_Ref: #PWR01065; #PWR0114_Ref: #PWR01066; #PWR0115_Ref: #PWR01067; #PWR0116_Ref: #PWR01068; #PWR0117_Ref: #PWR01077; #PWR0118_Ref: #PWR01078; #PWR0119_Ref: #PWR01079; #PWR0120_Ref: #PWR01080; #PWR0121_Ref: #PWR01093; #PWR0122_Ref: #PWR01094; #PWR0123_Ref: #PWR01095; #PWR0124_Ref: #PWR01096; #PWR0125_Ref: #PWR01111; #PWR0126_Ref: #PWR01112; #PWR0127_Ref: #PWR01117; #PWR0128_Ref: #PWR01118; #PWR0129_Ref: #PWR01127; #PWR0130_Ref: #PWR01128; #PWR0179_Ref: #PWR01129; #PWR0185_Ref: #PWR01130; #PWR0192_Ref: #PWR01141; #PWR0199_Ref: #PWR01142; #PWR0200_Ref: #PWR01143; #PWR0232_Ref: #PWR01144; #PWR0142_Ref: #PWR01056; #PWR042_Ref: #PWR01003; #PWR046_Ref: #PWR01006; #PWR091_Ref: #PWR01007; #PWR097_Ref: #PWR01009; #PWR0131_Ref: #PWR01010; #PWR0134_Ref: #PWR01012; #PWR0138_Ref: #PWR01013; #PWR044_Ref: #PWR01004; #PWR01167_Ref: #PWR0669; #PWR01169_Ref: #PWR0670; #PWR01296_Ref: #PWR0709; #PWR01297_Ref: #PWR0711; #PWR01295_Ref: #PWR0707; #PWR01171_Ref: #PWR0677; #PWR01165_Ref: #PWR0444; #PWR01163_Ref: #PWR0442; J23_Ref: J44; J7_Ref: J42; #PWR061_Ref: #PWR01061; #PWR070_Ref: #PWR01062; #PWR079_Ref: #PWR01063; #PWR088_Ref: #PWR01064; #PWR057_Ref: #PWR01073; #PWR066_Ref: #PWR01074; #PWR075_Ref: #PWR01075; #PWR084_Ref: #PWR01076; #PWR062_Ref: #PWR01089; #PWR071_Ref: #PWR01090; #PWR080_Ref: #PWR01091; #PWR089_Ref: #PWR01092; #PWR058_Ref: #PWR01105; #PWR067_Ref: #PWR01106; #PWR076_Ref: #PWR01107; #PWR085_Ref: #PWR01110; #PWR069_Ref: #PWR01018; #PWR078_Ref: #PWR01020; #PWR087_Ref: #PWR01022; #PWR063_Ref: #PWR01123; #PWR072_Ref: #PWR01124; #PWR081_Ref: #PWR01125; #PWR090_Ref: #PWR01126; #PWR059_Ref: #PWR01137; #PWR068_Ref: #PWR01138; #PWR077_Ref: #PWR01139; #PWR086_Ref: #PWR01140; #PWR060_Ref: #PWR01016; #PWR064_Ref: #PWR01046; #PWR073_Ref: #PWR01047; #PWR082_Ref: #PWR01048; #PWR055_Ref: #PWR01045; #PWR051_Ref: #PWR01136; #PWR035_Ref: #PWR01135; #PWR054_Ref: #PWR01122; #PWR047_Ref: #PWR01121; #PWR023_Ref: #PWR01120; #PWR012_Ref: #PWR01119; #PWR050_Ref: #PWR01104; #PWR033_Ref: #PWR01103; #PWR017_Ref: #PWR01102; #PWR07_Ref: #PWR01101; #PWR053_Ref: #PWR01088; #PWR045_Ref: #PWR01087; #PWR021_Ref: #PWR01086; #PWR010_Ref: #PWR01085; #PWR049_Ref: #PWR01072; #PWR031_Ref: #PWR01071; #PWR016_Ref: #PWR01070; #PWR06_Ref: #PWR01069; #PWR052_Ref: #PWR01060; #PWR043_Ref: #PWR01059; #PWR019_Ref: #PWR01058; #PWR08_Ref: #PWR01057; #PWR048_Ref: #PWR01052; #PWR029_Ref: #PWR01051; #PWR014_Ref: #PWR01050; #PWR05_Ref: #PWR01049; #PWR04_Ref: #PWR01040; #PWR03_Ref: #PWR01039; #PWR02_Ref: #PWR01038; #PWR01_Ref: #PWR01037
Peripheral Slot 8 = Slot_periph.SchDoc: SERVMOD (bidir), MGT_Tx_P (out), MGT_Tx_N (out), MGT_Rx_P (in), MGT_Rx_N (in), RST_N (in), I2C_SDA (bidir), I2C_SCL (in), DIFF_2_P (bidir), DIFF_2_N (bidir), DIFF_0_P (bidir), DIFF_0_N (bidir), DIFF_1_P (bidir), DIFF_1_N (bidir), DIFF_5_P (bidir), DIFF_5_N (bidir), DIFF_6_P (bidir), DIFF_6_N (bidir), DIFF_7_P (bidir), DIFF_7_N (bidir), DIFF_8_P (bidir), DIFF_8_N (bidir), DIFF_9_P (bidir), DIFF_9_N (bidir), DIFF_10_P (bidir), DIFF_10_N (bidir), DIFF_4_N (bidir), DIFF_4_P (bidir), DIFF_3_N (bidir), DIFF_3_P (bidir), CLK_N (in), CLK_P (in), GA3 (in), GA1 (in), GA2 (in), GA0 (in), RTM_SHARED_BUS[0..7] (bidir), SHARED_BUS_[0..4] (bidir), DIFF_11_P (bidir), DIFF_11_N (bidir), DIFF_12_P (bidir), DIFF_12_N (bidir), DIFF_13_P (bidir), DIFF_13_N (bidir), DIFF_14_P (bidir), DIFF_14_N (bidir), DIFF_15_P (bidir), DIFF_15_N (bidir)  | J8_Ref: J45; #PWR095_Ref: #PWR01147; #PWR0132_Ref: #PWR01150; #PWR0139_Ref: #PWR01153; #PWR0146_Ref: #PWR01156; #PWR092_Ref: #PWR01191; #PWR098_Ref: #PWR01192; #PWR0135_Ref: #PWR01193; #PWR093_Ref: #PWR01223; #PWR099_Ref: #PWR01224; #PWR0136_Ref: #PWR01225; #PWR0143_Ref: #PWR01226; #PWR096_Ref: #PWR01239; #PWR0133_Ref: #PWR01240; #PWR0140_Ref: #PWR01241; #PWR0147_Ref: #PWR01242; #PWR094_Ref: #PWR01267; #PWR0100_Ref: #PWR01268; #PWR0137_Ref: #PWR01269; #PWR0144_Ref: #PWR01270; J40_Ref: J47; #PWR0101_Ref: #PWR01168; #PWR0102_Ref: #PWR01170; #PWR0103_Ref: #PWR01172; #PWR0104_Ref: #PWR01166; #PWR0109_Ref: #PWR01177; #PWR0110_Ref: #PWR01178; #PWR0111_Ref: #PWR01179; #PWR0112_Ref: #PWR01180; #PWR0113_Ref: #PWR01207; #PWR0114_Ref: #PWR01208; #PWR0115_Ref: #PWR01209; #PWR0116_Ref: #PWR01210; #PWR0117_Ref: #PWR01219; #PWR0118_Ref: #PWR01220; #PWR0119_Ref: #PWR01221; #PWR0120_Ref: #PWR01222; #PWR0121_Ref: #PWR01235; #PWR0122_Ref: #PWR01236; #PWR0123_Ref: #PWR01237; #PWR0124_Ref: #PWR01238; #PWR0125_Ref: #PWR01251; #PWR0126_Ref: #PWR01252; #PWR0127_Ref: #PWR01253; #PWR0128_Ref: #PWR01254; #PWR0129_Ref: #PWR01263; #PWR0130_Ref: #PWR01264; #PWR0179_Ref: #PWR01265; #PWR0185_Ref: #PWR01266; #PWR0192_Ref: #PWR01287; #PWR0199_Ref: #PWR01288; #PWR0200_Ref: #PWR01289; #PWR0232_Ref: #PWR01290; #PWR0142_Ref: #PWR01194; #PWR042_Ref: #PWR01145; #PWR046_Ref: #PWR01148; #PWR091_Ref: #PWR01149; #PWR097_Ref: #PWR01151; #PWR0131_Ref: #PWR01152; #PWR0134_Ref: #PWR01154; #PWR0138_Ref: #PWR01155; #PWR044_Ref: #PWR01146; #PWR01167_Ref: #PWR0717; #PWR01169_Ref: #PWR0719; #PWR01296_Ref: #PWR0854; #PWR01297_Ref: #PWR0856; #PWR01295_Ref: #PWR0852; #PWR01171_Ref: #PWR0721; #PWR01165_Ref: #PWR0715; #PWR01163_Ref: #PWR0713; J23_Ref: J48; J7_Ref: J46; #PWR061_Ref: #PWR01203; #PWR070_Ref: #PWR01204; #PWR079_Ref: #PWR01205; #PWR088_Ref: #PWR01206; #PWR057_Ref: #PWR01215; #PWR066_Ref: #PWR01216; #PWR075_Ref: #PWR01217; #PWR084_Ref: #PWR01218; #PWR062_Ref: #PWR01231; #PWR071_Ref: #PWR01232; #PWR080_Ref: #PWR01233; #PWR089_Ref: #PWR01234; #PWR058_Ref: #PWR01247; #PWR067_Ref: #PWR01248; #PWR076_Ref: #PWR01249; #PWR085_Ref: #PWR01250; #PWR069_Ref: #PWR01160; #PWR078_Ref: #PWR01162; #PWR087_Ref: #PWR01164; #PWR063_Ref: #PWR01259; #PWR072_Ref: #PWR01260; #PWR081_Ref: #PWR01261; #PWR090_Ref: #PWR01262; #PWR059_Ref: #PWR01279; #PWR068_Ref: #PWR01280; #PWR077_Ref: #PWR01285; #PWR086_Ref: #PWR01286; #PWR060_Ref: #PWR01158; #PWR064_Ref: #PWR01182; #PWR073_Ref: #PWR01183; #PWR082_Ref: #PWR01184; #PWR055_Ref: #PWR01181; #PWR051_Ref: #PWR01278; #PWR035_Ref: #PWR01277; #PWR054_Ref: #PWR01258; #PWR047_Ref: #PWR01257; #PWR023_Ref: #PWR01256; #PWR012_Ref: #PWR01255; #PWR050_Ref: #PWR01246; #PWR033_Ref: #PWR01245; #PWR017_Ref: #PWR01244; #PWR07_Ref: #PWR01243; #PWR053_Ref: #PWR01230; #PWR045_Ref: #PWR01229; #PWR021_Ref: #PWR01228; #PWR010_Ref: #PWR01227; #PWR049_Ref: #PWR01214; #PWR031_Ref: #PWR01213; #PWR016_Ref: #PWR01212; #PWR06_Ref: #PWR01211; #PWR052_Ref: #PWR01202; #PWR043_Ref: #PWR01201; #PWR019_Ref: #PWR01200; #PWR08_Ref: #PWR01199; #PWR048_Ref: #PWR01188; #PWR029_Ref: #PWR01187; #PWR014_Ref: #PWR01186; #PWR05_Ref: #PWR01185; #PWR04_Ref: #PWR01176; #PWR03_Ref: #PWR01175; #PWR02_Ref: #PWR01174; #PWR01_Ref: #PWR01173
Power = Power.SchDoc: M_SCL (in), M_SDA (bidir), P_IO1 (bidir), P_IO2 (bidir), P_PRES1 (out), P_PRES2 (out), F_RST (in), F_IO0 (bidir), P_RST (in), P_IO0 (bidir), F_IO1 (bidir), P12V_Sense (in), RTN_Sense (in), PWRFAIL_N (out), PS_ON_N (in), PWRBTN_N (out), PRST_N (out), RTM_SHARED_BUS[0..7] (bidir)
System Slot P1-P5 = Slot_1.SchDoc: 1_SERVMOD (bidir), 2_CLK_P (out), 2_CLK_N (out), 2_SERVMOD (bidir), 3_CLK_P (out), 3_CLK_N (out), 3_SERVMOD (bidir), 4_CLK_P (out), 4_CLK_N (out), 4_SERVMOD (bidir), 5_SERVMOD (bidir), 5_CLK_P (out), 6_SERVMOD (bidir), 5_CLK_N (out), 6_CLK_P (out), 6_CLK_N (out), 7_SERVMOD (bidir), 7_CLK_P (out), 7_CLK_N (out), 8_SERVMOD (bidir), 8_CLK_P (out), 8_CLK_N (out), M_SCL (out), M_SDA (bidir), P_IO1 (bidir), P_IO2 (bidir), P_PRES1 (in), P_PRES2 (in), F_RST (out), F_IO0 (bidir), P_RST (out), P_IO0 (bidir), F_IO1 (bidir), 1_CLK_N (out), 1_CLK_P (out), 2_DIFF_0_P (bidir), 2_DIFF_0_N (bidir), 2_DIFF_1_P (bidir), 2_DIFF_1_N (bidir), 3_DIFF_0_P (bidir), 3_DIFF_0_N (bidir), 3_DIFF_1_P (bidir), 3_DIFF_1_N (bidir), 4_DIFF_0_P (bidir), 4_DIFF_0_N (bidir), 4_DIFF_1_P (bidir), 4_DIFF_1_N (bidir), 5_DIFF_0_P (bidir), 5_DIFF_0_N (bidir), 5_DIFF_1_P (bidir), 5_DIFF_1_N (bidir), 6_DIFF_0_P (bidir), 6_DIFF_0_N (bidir), 6_DIFF_1_P (bidir), 6_DIFF_1_N (bidir), 7_DIFF_0_P (bidir), 7_DIFF_0_N (bidir), 7_DIFF_1_P (bidir), 7_DIFF_1_N (bidir), 8_DIFF_0_P (bidir), 8_DIFF_0_N (bidir), 1_DIFF_0_P (bidir), 1_DIFF_0_N (bidir), 1_DIFF_1_P (bidir), 1_DIFF_1_N (bidir), 8_DIFF_1_N (bidir), 8_DIFF_1_P (bidir), 2_DIFF_2_P (bidir), 2_DIFF_2_N (bidir), 3_DIFF_2_P (bidir), 3_DIFF_2_N (bidir), 4_DIFF_2_P (bidir), 4_DIFF_2_N (bidir), 5_DIFF_2_P (bidir), 5_DIFF_2_N (bidir), 6_DIFF_2_P (bidir), 6_DIFF_2_N (bidir), 7_DIFF_2_P (bidir), 7_DIFF_2_N (bidir), 8_DIFF_2_P (bidir), 8_DIFF_2_N (bidir), 1_DIFF_2_P (bidir), 1_DIFF_2_N (bidir), 2_DIFF_3_N (bidir), 2_DIFF_3_P (bidir), 3_DIFF_3_N (bidir), 3_DIFF_3_P (bidir), 4_DIFF_3_N (bidir), 4_DIFF_3_P (bidir), 5_DIFF_3_N (bidir), 5_DIFF_3_P (bidir), 6_DIFF_3_N (bidir), 6_DIFF_3_P (bidir), 7_DIFF_3_N (bidir), 7_DIFF_3_P (bidir), 8_DIFF_3_N (bidir), 8_DIFF_3_P (bidir), 1_DIFF_3_N (bidir), 1_DIFF_3_P (bidir), 2_DIFF_4_N (bidir), 2_DIFF_4_P (bidir), 3_DIFF_4_N (bidir), 3_DIFF_4_P (bidir), 4_DIFF_4_N (bidir), 4_DIFF_4_P (bidir), 5_DIFF_4_N (bidir), 5_DIFF_4_P (bidir), 6_DIFF_4_N (bidir), 6_DIFF_4_P (bidir), 7_DIFF_4_N (bidir), 7_DIFF_4_P (bidir), 8_DIFF_4_N (bidir), 8_DIFF_4_P (bidir), 1_DIFF_4_N (bidir), 1_DIFF_4_P (bidir), 3_DIFF_5_P (bidir), 3_DIFF_5_N (bidir), 4_DIFF_5_P (bidir), 4_DIFF_5_N (bidir), 5_DIFF_5_P (bidir), 5_DIFF_5_N (bidir), 6_DIFF_5_P (bidir), 6_DIFF_5_N (bidir), 7_DIFF_5_P (bidir), 7_DIFF_5_N (bidir), 8_DIFF_5_P (bidir), 8_DIFF_5_N (bidir), 1_DIFF_5_P (bidir), 1_DIFF_5_N (bidir), 2_DIFF_6_P (bidir), 2_DIFF_6_N (bidir), 3_DIFF_6_P (bidir), 3_DIFF_6_N (bidir), 4_DIFF_6_P (bidir), 4_DIFF_6_N (bidir), 6_DIFF_6_P (bidir), 6_DIFF_6_N (bidir), 7_DIFF_6_P (bidir), 7_DIFF_6_N (bidir), 8_DIFF_6_P (bidir), 8_DIFF_6_N (bidir), 1_DIFF_6_P (bidir), 1_DIFF_6_N (bidir), 5_DIFF_6_N (bidir), 5_DIFF_6_P (bidir), 2_DIFF_5_N (bidir), 2_DIFF_5_P (bidir), 2_DIFF_7_P (bidir), 2_DIFF_7_N (bidir), 3_DIFF_7_P (bidir), 3_DIFF_7_N (bidir), 4_DIFF_7_P (bidir), 4_DIFF_7_N (bidir), 5_DIFF_7_P (bidir), 5_DIFF_7_N (bidir), 6_DIFF_7_P (bidir), 6_DIFF_7_N (bidir), 7_DIFF_7_P (bidir), 7_DIFF_7_N (bidir), 8_DIFF_7_P (bidir), 8_DIFF_7_N (bidir), 1_DIFF_7_P (bidir), 1_DIFF_7_N (bidir), 2_DIFF_8_P (bidir), 2_DIFF_8_N (bidir), 3_DIFF_8_P (bidir), 3_DIFF_8_N (bidir), 4_DIFF_8_P (bidir), 4_DIFF_8_N (bidir), 5_DIFF_8_P (bidir), 5_DIFF_8_N (bidir), 6_DIFF_8_P (bidir), 6_DIFF_8_N (bidir), 7_DIFF_8_P (bidir), 7_DIFF_8_N (bidir), 8_DIFF_8_P (bidir), 8_DIFF_8_N (bidir), 1_DIFF_8_P (bidir), 1_DIFF_8_N (bidir), 2_DIFF_9_P (bidir), 2_DIFF_9_N (bidir), 7_DIFF_9_P (bidir), 7_DIFF_9_N (bidir), 8_DIFF_9_P (bidir), 8_DIFF_9_N (bidir), 1_DIFF_9_P (bidir), 1_DIFF_9_N (bidir), 2_DIFF_10_P (bidir), 2_DIFF_10_N (bidir), 7_DIFF_10_P (bidir), 7_DIFF_10_N (bidir), 8_DIFF_10_P (bidir), 1_DIFF_10_P (bidir), 1_DIFF_10_N (bidir), 3_DIFF_9_P (bidir), 3_DIFF_9_N (bidir), 3_DIFF_10_P (bidir), 3_DIFF_10_N (bidir), 4_DIFF_9_P (bidir), 4_DIFF_9_N (bidir), 4_DIFF_10_P (bidir), 4_DIFF_10_N (bidir), 5_DIFF_9_P (bidir), 5_DIFF_9_N (bidir), 5_DIFF_10_P (bidir), 5_DIFF_10_N (bidir), 6_DIFF_9_P (bidir), 6_DIFF_9_N (bidir), 6_DIFF_10_N (bidir), 6_DIFF_10_P (bidir), I2C_SCL (out), I2C_SDA (bidir), 7_MGT_Tx_P (out), 7_MGT_Tx_N (out), 7_MGT_Rx_P (in), 7_MGT_Rx_N (in), 8_MGT_Tx_P (out), 8_MGT_Tx_N (out), 8_MGT_Rx_P (in), 8_MGT_Rx_N (in), 2_MGT_Tx_P (out), 2_MGT_Tx_N (out), 2_MGT_Rx_P (in), 2_MGT_Rx_N (in), 1_MGT_Tx_P (out), 1_MGT_Tx_N (out), 1_MGT_Rx_P (in), 1_MGT_Rx_N (in), PS_ON_N (out), PWRFAIL_N (in), PWRBTN_N (in), PRST_N (in), RST_N (out), 3_MGT_Tx_P (out), 3_MGT_Tx_N (out), 3_MGT_Rx_P (in), 3_MGT_Rx_N (in), 4_MGT_Tx_P (out), 4_MGT_Tx_N (out), 4_MGT_Rx_P (in), 4_MGT_Rx_N (in), 5_MGT_Tx_P (out), 5_MGT_Tx_N (out), 5_MGT_Rx_P (in), 5_MGT_Rx_N (in), 6_MGT_Tx_P (out), 6_MGT_Tx_N (out), 6_MGT_Rx_P (in), 6_MGT_Rx_N (in), SHARED_BUS_[0..4] (bidir), P12V_Sense (out), RTN_Sense (out), 8_DIFF_10_N (bidir), 1_DIFF_15_P (bidir), 1_DIFF_15_N (bidir), 5_DIFF_15_P (bidir), 5_DIFF_15_N (bidir), 2_DIFF_15_P (bidir), 2_DIFF_15_N (bidir), 6_DIFF_15_N (bidir), 6_DIFF_15_P (bidir), 3_DIFF_15_P (bidir), 3_DIFF_15_N (bidir), 7_DIFF_15_P (bidir), 7_DIFF_15_N (bidir), 4_DIFF_15_P (bidir), 4_DIFF_15_N (bidir), 8_DIFF_15_P (bidir), 8_DIFF_15_N (bidir)
System Slot P6 = Slot_1b.SchDoc: 1_DIFF_11_P (bidir), 1_DIFF_11_N (bidir), 1_DIFF_12_P (bidir), 1_DIFF_12_N (bidir), 1_DIFF_13_P (bidir), 1_DIFF_13_N (bidir), 1_DIFF_14_P (bidir), 1_DIFF_14_N (bidir), 2_DIFF_11_P (bidir), 2_DIFF_11_N (bidir), 2_DIFF_12_P (bidir), 2_DIFF_12_N (bidir), 2_DIFF_13_P (bidir), 2_DIFF_13_N (bidir), 2_DIFF_14_P (bidir), 2_DIFF_14_N (bidir), 3_DIFF_11_P (bidir), 3_DIFF_11_N (bidir), 3_DIFF_12_P (bidir), 3_DIFF_12_N (bidir), 3_DIFF_13_P (bidir), 3_DIFF_13_N (bidir), 3_DIFF_14_P (bidir), 3_DIFF_14_N (bidir), 4_DIFF_11_P (bidir), 4_DIFF_11_N (bidir), 4_DIFF_12_P (bidir), 4_DIFF_12_N (bidir), 4_DIFF_13_P (bidir), 4_DIFF_13_N (bidir), 4_DIFF_14_P (bidir), 4_DIFF_14_N (bidir), 5_DIFF_11_P (bidir), 5_DIFF_11_N (bidir), 5_DIFF_12_P (bidir), 5_DIFF_12_N (bidir), 5_DIFF_13_P (bidir), 5_DIFF_13_N (bidir), 5_DIFF_14_P (bidir), 5_DIFF_14_N (bidir), 6_DIFF_11_P (bidir), 6_DIFF_11_N (bidir), 6_DIFF_12_P (bidir), 6_DIFF_12_N (bidir), 6_DIFF_13_P (bidir), 6_DIFF_13_N (bidir), 6_DIFF_14_P (bidir), 6_DIFF_14_N (bidir), 7_DIFF_11_P (bidir), 7_DIFF_11_N (bidir), 7_DIFF_12_P (bidir), 7_DIFF_12_N (bidir), 7_DIFF_13_P (bidir), 7_DIFF_13_N (bidir), 7_DIFF_14_P (bidir), 7_DIFF_14_N (bidir), 8_DIFF_11_P (bidir), 8_DIFF_11_N (bidir), 8_DIFF_12_P (bidir), 8_DIFF_12_N (bidir), 8_DIFF_13_P (bidir), 8_DIFF_13_N (bidir), 8_DIFF_14_P (bidir), 8_DIFF_14_N (bidir)